# Altium schematic sheet USB.SchDoc
size A4; SheetNumber: 3; SheetTotal: 4
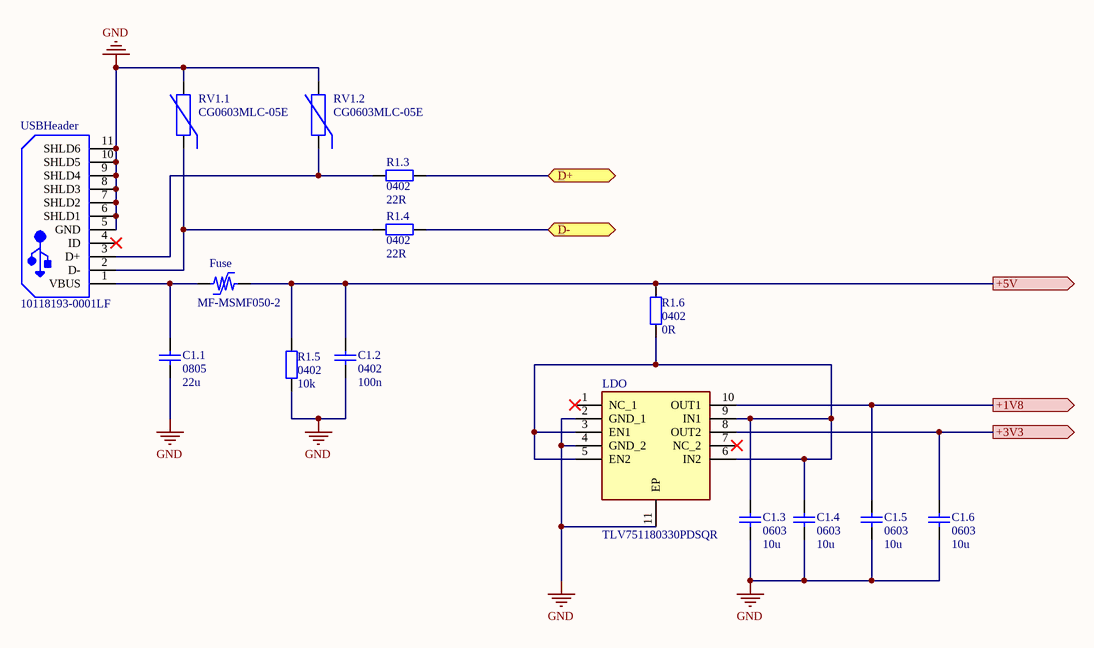
[diagram p0: USB.SchDoc]

## Parts
C1.1  0805  value 22u  [C0805_M]
C1.2  0402  value 100n  [C0402_M]
C1.3  0603  value 10u  [C0603_M]
C1.4  0603  value 10u  [C0603_M]
C1.5  0603  value 10u  [C0603_M]
C1.6  0603  value 10u  [C0603_M]
Fuse  MF-MSMF050-2  [BOUR-MF-MSMF050-2_V]
LDO  TLV751180330PDSQR  [SON40P200X200X80-11N]
R1.3  0402  value 22R  [R0402_M]
R1.4  0402  value 22R  [R0402_M]
R1.5  0402  value 10k  [R0402_M]
R1.6  0402  value 0R  [R0402_M]
RV1.1  CG0603MLC-05E  [BOUR-CG0603-2_V]
RV1.2  CG0603MLC-05E  [BOUR-CG0603-2_V]
USBHeader  10118193-0001LF  [FCI-10118193-0001LF-5_V]

## Ports
+1V8 (out), +3V3 (out), +5V (out), D+ (bidir), D- (bidir)

## Nets
GND: C1.1.1 C1.2.1 C1.3.1 C1.4.1 C1.5.1 C1.6.1 LDO.2(GND_1) LDO.4(GND_2) LDO.11(EP) R1.5.1 RV1.1.2 RV1.2.2 USBHeader.5(GND) USBHeader.6(SHLD1) USBHeader.7(SHLD2) USBHeader.8(SHLD3) USBHeader.9(SHLD4) USBHeader.10(SHLD5) USBHeader.11(SHLD6)
+1V8: C1.5.2 LDO.10(OUT1) ; port +1V8
+3V3: C1.6.2 LDO.8(OUT2) ; port +3V3
+5V: C1.2.2 Fuse.2 R1.5.2 R1.6.2 ; port +5V
D+: R1.3.2 ; port D+
D-: R1.4.2 ; port D-
NetC1.1_2: C1.1.2 Fuse.1 USBHeader.1(VBUS)
NetC1.3_2: C1.3.2 C1.4.2 LDO.3(EN1) LDO.5(EN2) LDO.6(IN2) LDO.9(IN1) R1.6.1
NetR1.3_1: R1.3.1 RV1.2.1 USBHeader.3(D+)
NetR1.4_1: R1.4.1 RV1.1.1 USBHeader.2(D-)

Not connected (* = marked no-connect by the designer): LDO 1(NC_1)* 7(NC_2)*; USBHeader 4(ID)*

## Library data of the parts
C1.1 = C0805_X5R_22u_20%: Capacitor; Manufactor: Walsin; ManufactorPartNumber: 0805X226M6R3CT; Tech: MLCC X5R; VoltageRating: 6.3V; TempRating: -55°C to +125°C; Tolerance: 20%; Part Number: C0805_X5R_22u_20%; Type: Capacitor; Supplier 1: Farnell; Supplier Part Number 1: 2497053
C1.2 = C0402_X7R_100n_10%: Capacitor; Manufactor: Yageo; ManufactorPartNumber: CC0402KRX7R7BB104; Tech: MLCC X7R; VoltageRating: 16V; TempRating: -55°C to +125°C; Tolerance: 10%; Part Number: C0402_X7R_100n_10%; Type: Capacitor; Supplier 1: Farnell; Supplier Part Number 1: 9402047
C1.3-C1.6 = C0603_X5R_10u_10%: Capacitor; Manufactor: Yageo; ManufactorPartNumber: CC0603MRX5R5BB106; Tech: MLCC X5R; VoltageRating: 6,3V; TempRating: -55°C to +85°C; Tolerance: 10%; Part Number: C0603_X5R_10u_10%; Type: Capacitor; Supplier 1: Farnell; Supplier Part Number 1: 1458902
Fuse = CMP-2100-03653-1: PTC Resettable Fuse, 15 V, 500 mA, -40 to 85 degC, 2-Pin SMD, RoHS, Tape and Reel; Manufacturer: Bourns; Voltage Rating (DC): 15V; Max Current Rating: 100A; Power Dissipation: 800mW; Resistance: 150mOhm; Width: 3.41mm; Package Quantity: 2000; Voltage Rating: 15V; RoHSCompliant: true; Contact Plating: Gold; REACH SVHC: NoSVHC; Datasheet URL: http://www.bourns.com/docs/Product-Datasheets/mfmsmf.pdf; Lead Free: LeadFree; Height: 0.85mm; Min Operating Temperature: -40degC; Case Code (Metric): 4532; Number of Terminals: 2; Case Code (Imperial): 1812; Case/Package: 1812; Current Rating: 100A; Length: 4.73mm; Max Operating Temperature: 85degC; Package Reference: MF-MSMF050-2; Radiation Hardening: No; Datasheet Version: Rev. AG, 08/2016; Packaging: TapeandReel; Termination: SMD/SMT; Supply Voltage: 15V; Manufacturer URL: http://www.bourns.com/; Mount: SurfaceMount; Package Description: 2-Pin Surface Mount Device, Body 4.55 x 3.24 mm
LDO = TLV751180330PDSQR: Integrated Circuit; Manufacturer_Name: Texas Instruments; Datasheet Link: https://www.arrow.com/en/products/tlv751180330pdsqr/texas-instruments; Height: 0.8mm; Manufacturer_Part_Number: TLV751180330PDSQR; Mouser Part Number: 595-LV751180330PDSQR; Mouser Price/Stock: https://www.mouser.co.uk/ProductDetail/Texas-Instruments/TLV751180330PDSQR/?qs=TiOZkKH1s2TTHzmF98psZw%3D%3D; Arrow Part Number: TLV751180330PDSQR; Arrow Price/Stock: https://www.arrow.com/en/products/tlv751180330pdsqr/texas-instruments
R1.3 R1.4 = R0402_1%_220R: Resistor; Manufactor: Vishay; ManufactorPartNumber: CRCW0402220RFKEDHP; Tech: Dickschicht; VoltageRating: 50V; PowerRating: 0,125W; Tolerance: 1%; Part Number: R0402_1%_220R; Type: Resistor
R1.5 = R0402_1%_10k: Resistor; Manufactor: Vishay; ManufactorPartNumber: CRCW040210K0FKEDHP; Tech: Dickschicht; VoltageRating: 50V; PowerRating: 0,125W; Tolerance: 1%; Part Number: R0402_1%_10k; Type: Resistor; Supplier 1: Digi-Key; Supplier Part Number 1: 541-10.0KYCT-ND; Supplier 2: Farnell; Supplier Part Number 2: 1738864
R1.6 = R0402_1%_0R: Resistor; Manufactor: Multicomp; ManufactorPartNumber: MC00625W040210R; Tech: Dickschicht; VoltageRating: 50V; PowerRating: 0,0625W; Tolerance: 1%; Part Number: R0402_1%_0R; Type: Resistor; Supplier 1: Farnell; Supplier Part Number 1: 1357983
RV1.1 RV1.2 = CMP-0584-00001-2: ESD Protector, 5 V Supply, -40 to 85 degC, 1.6 x 0.8 x 0.55 mm SMD, RoHS, Tape and Reel; Manufacturer: Bourns; VC: 20 V; VT: 150 V; RT: 1 ns; VDC: 5 V; CO: 0.5 pF; PartNumber: CG0603MLC-05E; ComponentLink1Description: Manufacturer URL; ComponentLink1URL: http://www.bourns.com/; Packing: Tape and Reel; Mounting Technology: Surface Mount; ComponentLink2Description: Datasheet; RoHS: TRUE; Operating Temperature: -40 to 85 degC; DatasheetVersion: Rev. S; PackageDescription: 2-Pin SMD, Body 1.6 x 0.8 mm, Pitch 1.52 mm; PackageReference: CG0603-2; ComponentLink2URL: http://www.bourns.com/data/global/pdfs/MLC.pdf
USBHeader = CMP-2000-05119-1: Micro USB B Type Receptacle, -55 to 85 degC, 5-Pin SMD, RoHS, Tape and Reel; Manufacturer: FCI; Insulation Resistance: 1000MOhms; Gender: Female; Current Rating: 1.8A; Number of Contacts: 5Contact; Connector Type: MicroUSBTypeBreceptacle; Mounting Angle: Right; Datasheet Version: Rev. C, 05/2015; Packaging: Reel; Product Category: USBConnectors; Standard: USB2.0; Factory Pack Quantity: 1200; Operating Temperature Range: -55Cto+85C; Termination Style: SMD/SMT; Datasheet URL: http://datasheet.octopart.com/10118193-0001LF-FCI-datasheet-55953155.pdf; Contact Material: CopperAlloy; RoHS: Details; Contact Plating: Gold; Flammability Rating: UL94V-0; Manufacturer URL: http://www.fci.com/; Brand: FCI; Product: MicroUSBTypeBConnectors; Color: Black